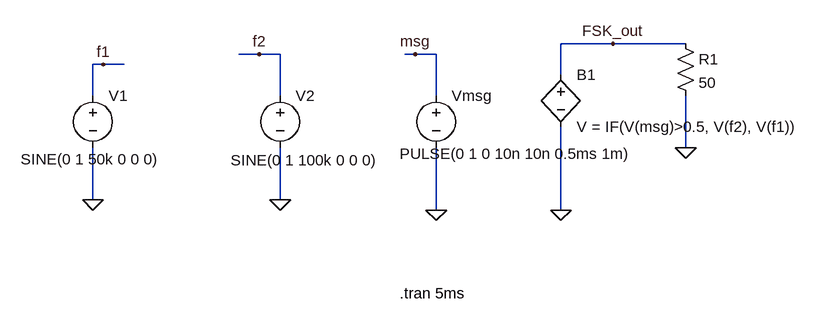
[diagram p0: schematic exp10_fsk.asc]
exp10_fsk.asc, the LTspice schematic file:
Version 4.1
SHEET 1 1076 680
WIRE 752 16 672 16
WIRE 864 16 752 16
WIRE 208 32 176 32
WIRE 240 32 208 32
WIRE 448 32 432 32
WIRE 480 32 448 32
WIRE -32 48 -48 48
WIRE 0 48 -32 48
WIRE 672 64 672 16
WIRE -48 96 -48 48
WIRE 240 96 240 32
WIRE 480 96 480 32
WIRE 864 176 864 96
WIRE -48 256 -48 176
WIRE 240 256 240 176
WIRE 480 272 480 176
WIRE 672 272 672 144
FLAG 240 256 0
FLAG -48 256 0
FLAG -32 48 f1
FLAG 208 32 f2
FLAG 480 272 0
FLAG 448 32 msg
FLAG 672 272 0
FLAG 864 176 0
FLAG 752 16 FSK_out
SYMBOL voltage -48 80 R0
WINDOW 3 -111 114 Left 2
WINDOW 123 0 0 Left 0
WINDOW 39 0 0 Left 0
SYMATTR InstName V1
SYMATTR Value SINE(0 1 50k 0 0 0)
SYMBOL voltage 240 80 R0
WINDOW 3 -76 115 Left 2
WINDOW 123 0 0 Left 0
WINDOW 39 0 0 Left 0
SYMATTR InstName V2
SYMATTR Value SINE(0 1 100k 0 0 0)
SYMBOL voltage 480 80 R0
WINDOW 3 -56 105 Left 2
WINDOW 123 0 0 Left 0
WINDOW 39 0 0 Left 0
SYMATTR InstName Vmsg
SYMATTR Value PULSE(0 1 0 10n 10n 0.5ms 1m)
SYMBOL bv 672 48 R0
SYMATTR InstName B1
SYMATTR Value V = IF(V(msg)>0.5, V(f2), V(f1))
SYMBOL res 848 0 R0
SYMATTR InstName R1
SYMATTR Value 50
TEXT 424 400 Left 2 !.tran 5ms

The netlist it stands for:
* exp10_fsk.asc
V1 f1 0 SINE(0 1 50k 0 0 0)
V2 f2 0 SINE(0 1 100k 0 0 0)
Vmsg msg 0 PULSE(0 1 0 10n 10n 0.5ms 1m)
B1 FSK_out 0 V = IF(V(msg)>0.5, V(f2), V(f1))
R1 FSK_out 0 50
.tran 5ms
.backanno
.end